# EAGLE schematic Regulator_Switching_TPS6216X_TPS6217X (EAGLE 6.5.0)
Switching RegulatorL TPS621XX This block supports the fixed voltage regulators of this family: TPS62171 (1.8V), TPS62172 (3.3V), TPS62173 (5.0V) TPS62161 (1.8V), TPS62162 (3.3V), TPS62163 (5.0V) TPS6217X <http://www.ti.com/lit/ds/symlink/tps62172.pdf> TPS6216X <http://www.ti.com/lit/ds/symlink/tps62160.pdf> Includes all capacitors and inductors required. Input voltages between output voltage and 17. If using V_BATT or V_SUPP, ensure the voltage does not fall out of these limits. Rated to 0.5A for TPS6217X. Rated to 1.0A for TPS6216X
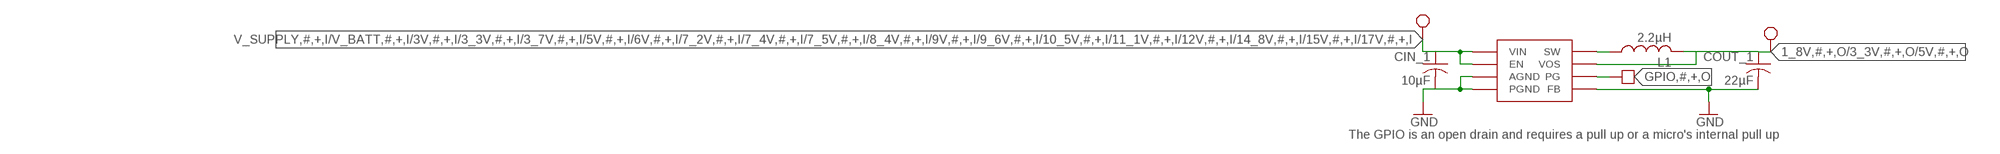
[diagram p0: schematic, sheet 1]

## Parts
CIN_1  10µF  C-USC0603  [C0603]
COUT_1  22µF  C-USC0603  [C0603]
L1  2.2µH  L-USL2012C  [L2012C]
U$1  TPS621XX  [8-WFDFN]

## Nets
1_8V,#,+,O/3_3V,#,+,O/5V,#,+,O: COUT_1.1 L1.2 U$1.P$6(VOS) ; supply symbol labelled BLOCK_REQUIREMENT
GND: CIN_1.2 COUT_1.2 U$1.P$1(PGND) U$1.P$4(AGND) U$1.P$5(FB) U$1.P$9(AGND)
GPIO,#,+,O: U$1.P$8(PG) ; supply symbol labelled BLOCK_OPTIONAL
N$1: L1.1 U$1.P$7(SW)
V_SUPPLY,#,+,I/V_BATT,#,+,I/3V,#,+,I/3_3V,#,+,I/3_7V,#,+,I/5V,#,+,I/6V,#,+,I/7_2V,#,+,I/7_4V,#,+,I/7_5V,#,+,I/8_4V,#,+,I/9V,#,+,I/9_6V,#,+,I/10_5V,#,+,I/11_1V,#,+,I/12V,#,+,I/14_8V,#,+,I/15V,#,+,I/17V,#,+,I: CIN_1.1 U$1.P$2(VIN) U$1.P$3(EN) ; supply symbol labelled BLOCK_REQUIREMENT

## Notes on the sheet
- The GPIO is an open drain and requires a pull up or a micro's internal pull up

## Library data of the parts
CIN_1 COUT_1 = rcl:C-US: CAPACITOR, American symbol
L1 = rcl:L-US: INDUCTOR, American symbol
U$1 = piccoli:TPS621XX